# Altium schematic sheet ESP_GSM_V1.1.SchDoc: EGBV01R01130122
size A2; SheetNumber: 1; SheetTotal: 1
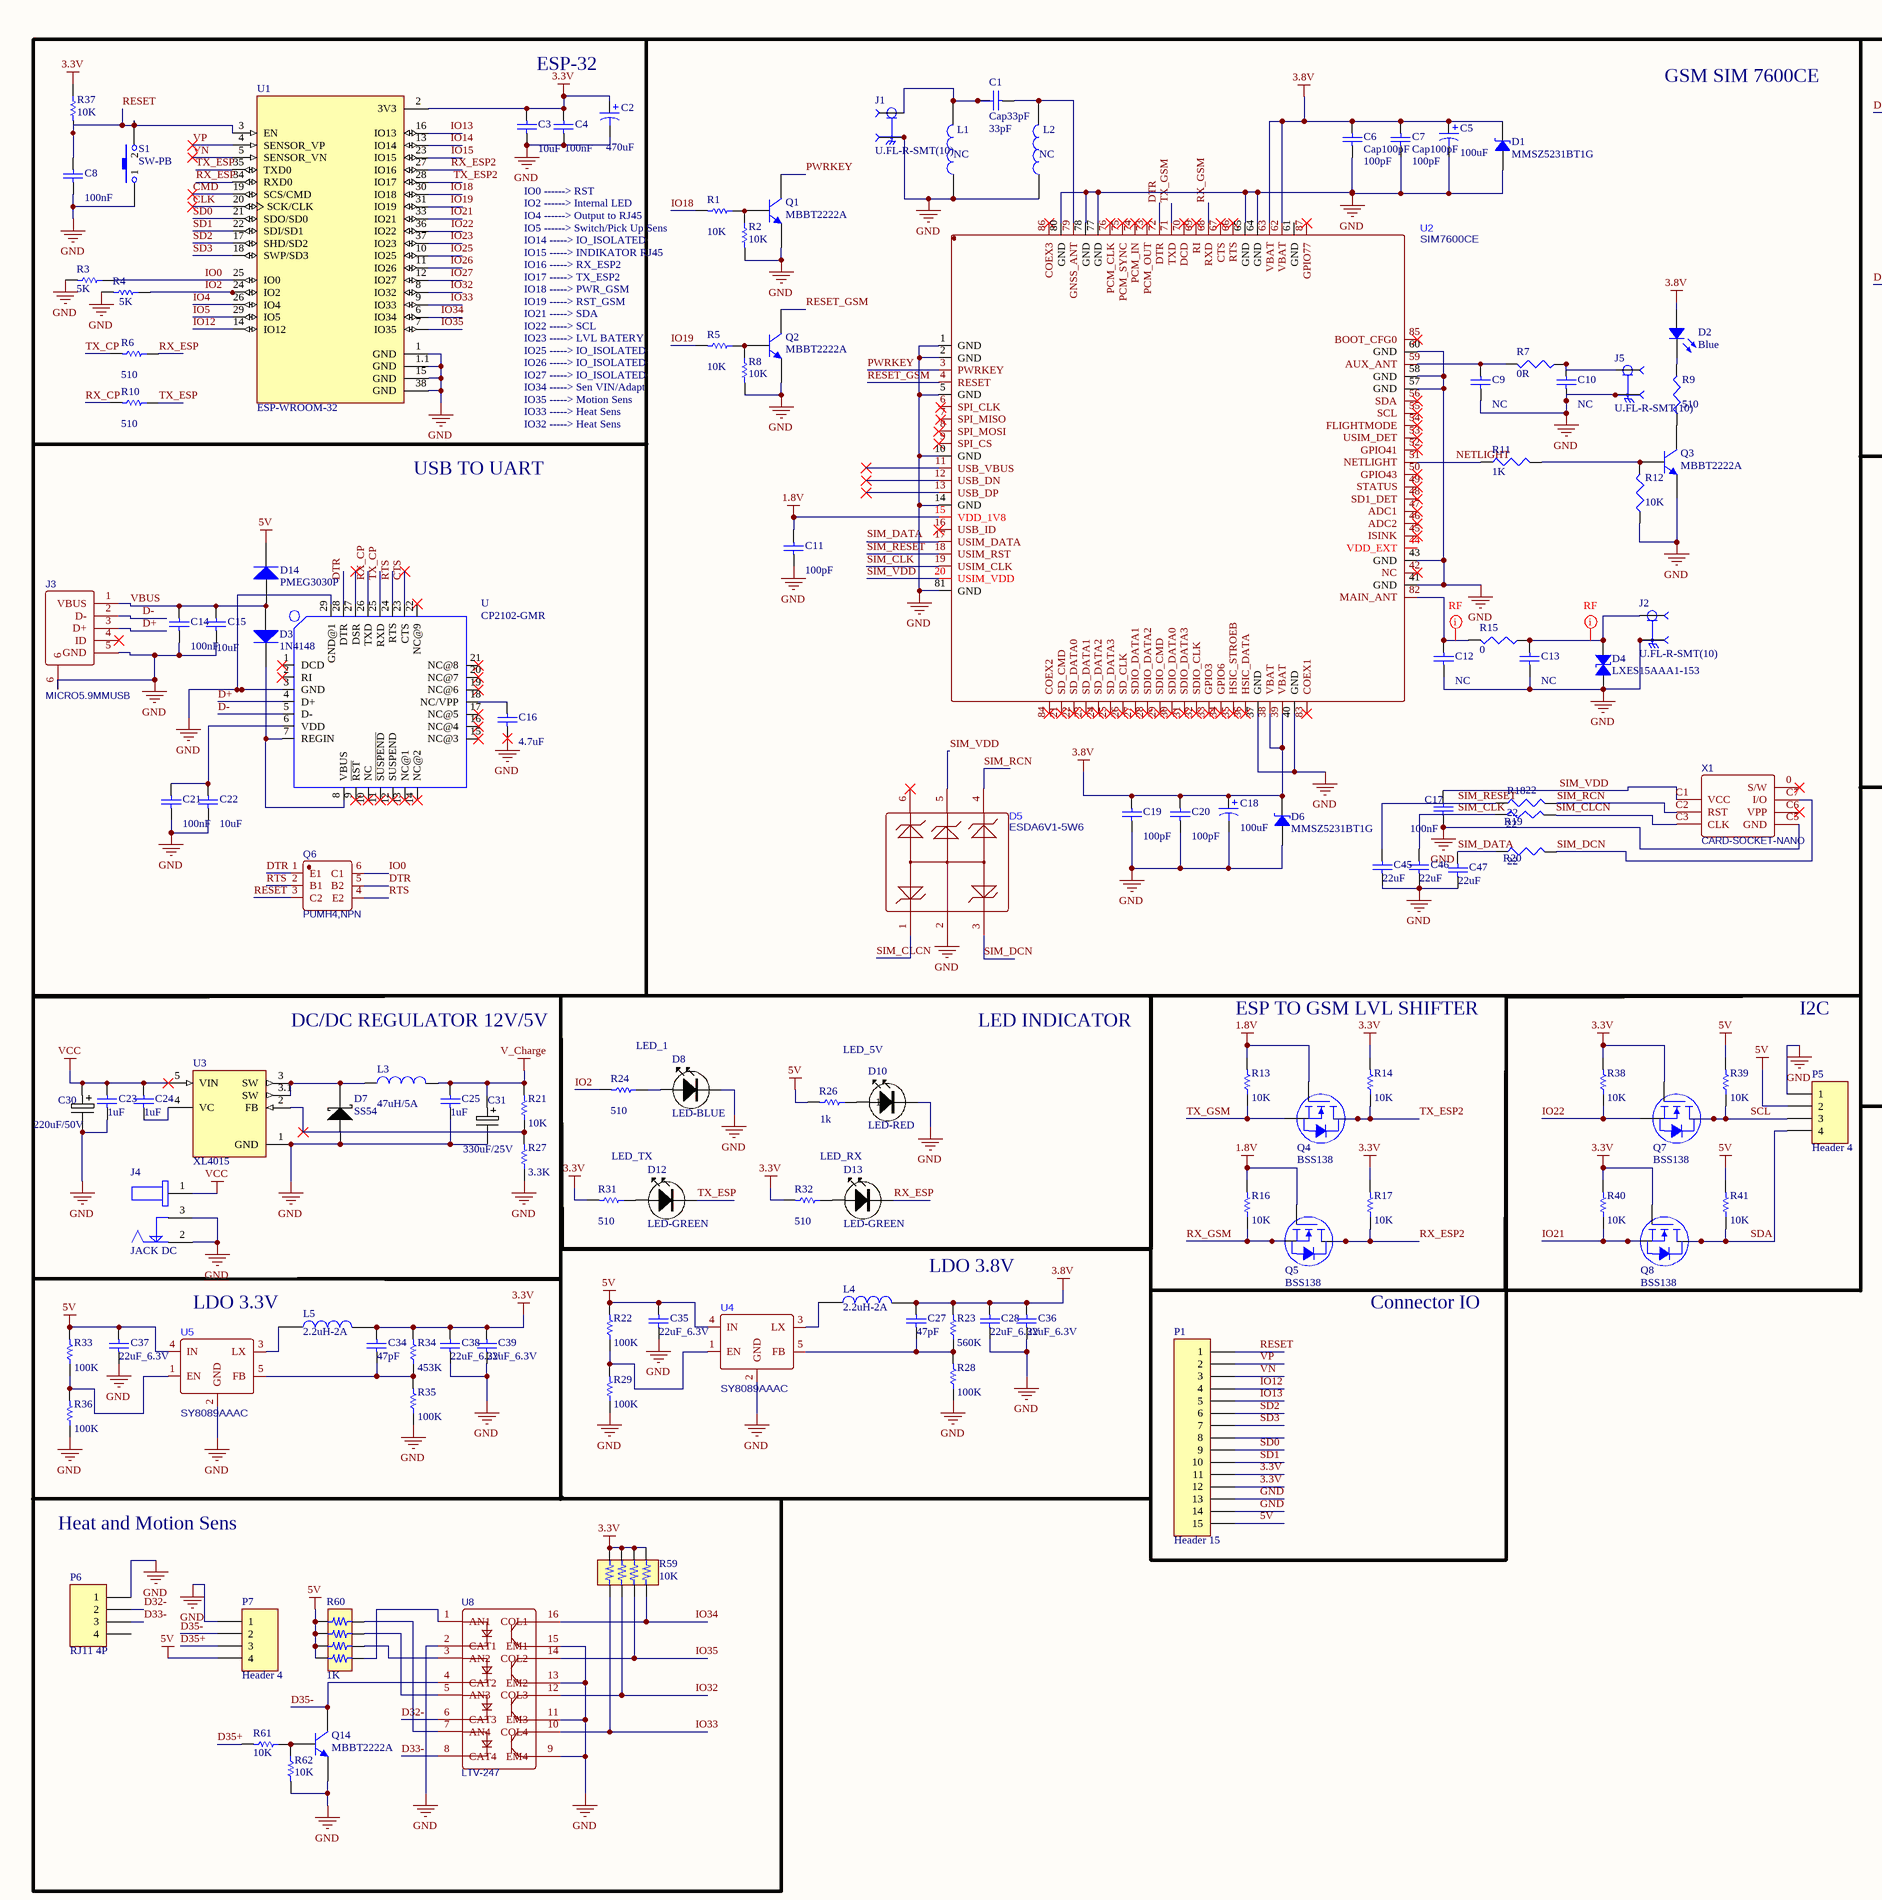
[diagram p0: ESP_GSM_V1.1.SchDoc, left]
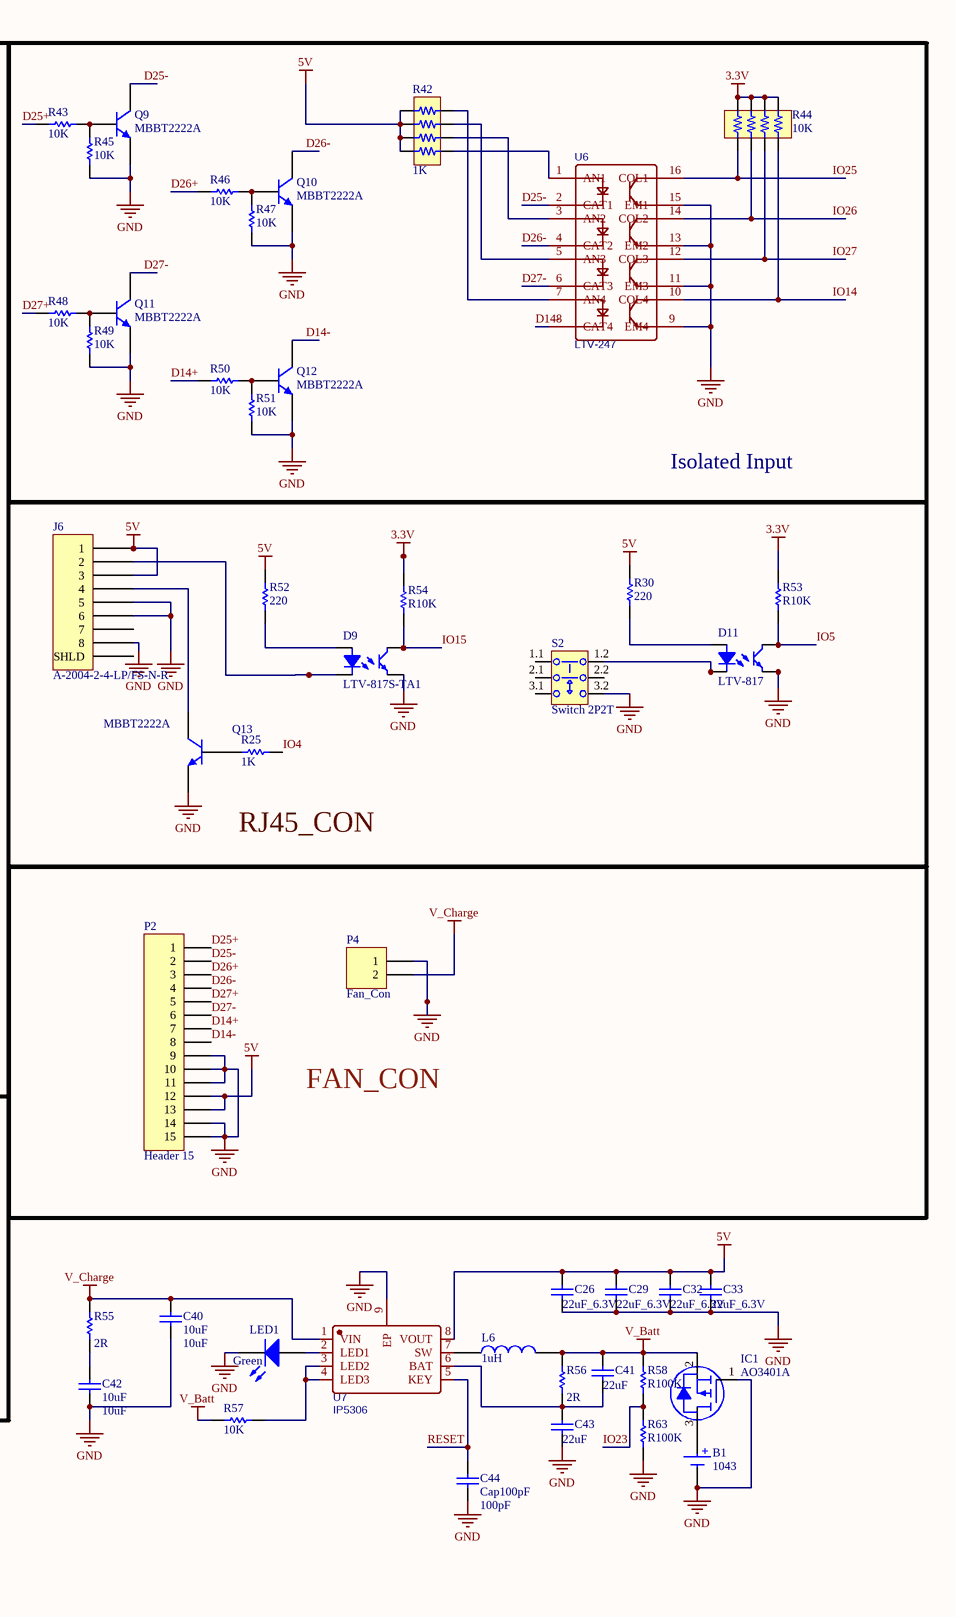
[diagram p1: ESP_GSM_V1.1.SchDoc, right]

## Parts
B1  1043  [KEYSTONE 1043]
C1  Cap33pF  value 33pF  [0603]
C2  value 470uF  [CAP-SMD_L7.3-W4.3-R-RD]  (hidden comment: CTantalum470uF)
C3  value 10uF  [0603]  (hidden comment: Cap10uF)
C4  value 100nF  [0603]  (hidden comment: Cap100nF)
C5  value 100uF  [CAP-SMD_L6.0-W3.2-R-RD]  (hidden comment: CTantalum100uF)
C6  Cap100pF  value 100pF  [0603]
C7  Cap100pF  value 100pF  [0603]
C8  value 100nF  [0603]  (hidden comment: Cap100nF)
C9  NC  [0603]
C10  NC  [0603]
C11  value 100pF  [0603]  (hidden comment: Cap100pF)
C12  NC  [0603]
C13  NC  [0603]
C14  value 100nF  [0603]  (hidden comment: Cap100nF)
C15  value 10uF  [0603]  (hidden comment: Cap10uF)
C16  value 4.7uF  [0603]  (hidden comment: Cap4.7uF)
C17  value 100nF  [0603]  (hidden comment: C100nF)
C18  value 100uF  [CAP-SMD_L6.0-W3.2-R-RD]  (hidden comment: CTantalum100uF)
C19  value 100pF  [0603]  (hidden comment: Cap100pF)
C20  value 100pF  [0603]  (hidden comment: Cap100pF)
C21  value 100nF  [0603]  (hidden comment: Cap100nF)
C22  10uF  [0603]
C23  value 1uF  [0603]  (hidden comment: Cap1uF)
C24  value 1uF  [0603]  (hidden comment: Cap1uF)
C25  value 1uF  [0603]  (hidden comment: Cap1uF)
C26  value 22uF_6.3V  [6-0805_N]  (hidden comment: Cap22uF)
C27  value 47pF  [0603]  (hidden comment: Cap47pF)
C28  value 22uF_6.3V  [6-0805_N]  (hidden comment: Cap22uF)
C29  value 22uF_6.3V  [6-0805_N]  (hidden comment: Cap22uF)
C30  220uF/50V  [CAP ALUM 10.3MM]
C31  330uF/25V  [CAP ALSMD POLY 8.3MM H10.5MM]
C32  value 22uF_6.3V  [6-0805_N]  (hidden comment: Cap22uF)
C33  value 22uF_6.3V  [6-0805_N]  (hidden comment: Cap22uF)
C34  47pF  [0603]
C35  value 22uF_6.3V  [6-0805_N]  (hidden comment: Cap22uF)
C36  value 22uF_6.3V  [6-0805_N]  (hidden comment: Cap22uF)
C37  value 22uF_6.3V  [6-0805_N]  (hidden comment: Cap22uF)
C38  value 22uF_6.3V  [6-0805_N]  (hidden comment: Cap22uF)
C39  value 22uF_6.3V  [6-0805_N]  (hidden comment: Cap22uF)
C40  10uF  [1608[0603]]
C41  value 22uF  [1608[0603]]  (hidden comment: Cap22uF)
C42  10uF  [1608[0603]]
C43  value 22uF  [1608[0603]]  (hidden comment: Cap22uF)
C44  Cap100pF  value 100pF  [1608[0603]]
C45  value 22uF  [1608[0603]]  (hidden comment: Cap22uF)
C46  value 22uF  [1608[0603]]  (hidden comment: Cap22uF)
C47  value 22uF  [1608[0603]]  (hidden comment: Cap22uF)
D1  MMSZ5231BT1G  [SOD-123]
D2  Blue  [LED 0805_2012 BLUE]
D3  1N4148  [SOD-123]
D4  LXES15AAA1-153  [0402]
D5  ESDA6V1-5W6  [SOT-363_L2.0-W1.3-P0.65-LS2.1-TL]
D6  MMSZ5231BT1G  [SOD-123]
D7  SS54  [DO214AC SMA]
D8  LED-BLUE  [LED 0805_2012 RED]
D9  LTV-817S-TA1  [LITEON LTV-817]
D10  LED-RED  [LED 0805_2012 RED]
D11  LTV-817  [LITEON LTV-817]
D12  LED-GREEN  [LED 0805_2012 RED]
D13  LED-GREEN  [LED 0805_2012 RED]
D14  PMEG3030P  [SOD-128_L3.7-W2.5-LS4.7-RD]
IC1  AO3401A  [DIODES SOT-23-3]
J1  U.FL-R-SMT(10)  [HRS_U.FL-R-SMT(10)]
J2  U.FL-R-SMT(10)  [HRS_U.FL-R-SMT(10)]
J3  MICRO5.9MMUSB  [MICRO-USB-SMD_5P-P0.65-H-F_MICRO5.9MMUSB]
J4  JACK DC  [Jack DC]
J5  U.FL-R-SMT(10)  [HRS_U.FL-R-SMT(10)]
J6  A-2004-2-4-LP/FS-N-R  [ASSMANN A-2004-2-4-LP_FS]
L1  NC  [0603]
L2  NC  [0603]
L3  47uH/5A  [INDUCTOR 2012H]
L4  2.2uH-2A  [IND-SMD_L4.5-W4.1_TMPC0412HP]
L5  2.2uH-2A  [IND-SMD_L4.5-W4.1_TMPC0412HP]
L6  1uH  [IND-SMD_L4.5-W4.1_TMPC0412HP]
LED1  Green  [LED 0805_2012 RED]
P1  Header 15  [HDR1X15]
P2  Header 15  [HDR1X15]
P4  Fan_Con  [JST XH B2B-XH-A]
P5  Header 4  [HDR1X4]
P6  RJ11 4P  [RJ11 4PC4 Right]
P7  Header 4  [HDR1X4]
Q1  MBBT2222A  [SOT-23B_N]
Q2  MBBT2222A  [SOT-23B_N]
Q3  MBBT2222A  [SOT-23B_N]
Q4  BSS138  [ON SEMI SOT-23-3]
Q5  BSS138  [ON SEMI SOT-23-3]
Q6  PUMH4,NPN  [SOT-363_L2.0-W1.3-P0.65-LS2.1-BR]
Q7  BSS138  [ON SEMI SOT-23-3]
Q8  BSS138  [ON SEMI SOT-23-3]
Q9  MBBT2222A  [SOT-23B_N]
Q10  MBBT2222A  [SOT-23B_N]
Q11  MBBT2222A  [SOT-23B_N]
Q12  MBBT2222A  [SOT-23B_N]
Q13  MBBT2222A  [SOT-23B_N]
Q14  MBBT2222A  [SOT-23B_N]
R1  value 10K  [0603]  (hidden comment: R10K)
R2  value 10K  [0603]  (hidden comment: R10K)
R3  value 5K  [0603]  (hidden comment: R5K)
R4  value 5K  [0603]  (hidden comment: R5K)
R5  R10K  [0603]  (value not drawn)
R6  value 510  [0603]  (hidden comment: R510)
R7  value 0R  [0603]  (hidden comment: R0)
R8  value 10K  [0603]  (hidden comment: R10K)
R9  value 510  [0603]  (hidden comment: R510)
R10  value 510  [0603]  (hidden comment: R510)
R11  1K  [J1-0603]
R12  value 10K  [0603]  (hidden comment: R10K)
R13  value 10K  [0603]  (hidden comment: R10K)
R14  value 10K  [0603]  (hidden comment: R10K)
R15  value 0  [J1-0603]  (hidden comment: R0)
R16  value 10K  [0603]  (hidden comment: R10K)
R17  value 10K  [0603]  (hidden comment: R10K)
R18  22  [J1-0603]
R19  22  [J1-0603]
R20  22  [J1-0603]
R21  value 10K  [0603]  (hidden comment: R10K)
R22  value 100K  [0603]  (hidden comment: R100K)
R23  value 560K  [0603]  (hidden comment: R560K)
R24  value 510  [0603]  (hidden comment: R510)
R25  1K  [1608[0603]]
R26  value 1k  [0603]  (hidden comment: R1K)
R27  value 3.3K  [0603]  (hidden comment: R3.3K)
R28  value 100K  [0603]  (hidden comment: R100K)
R29  value 100K  [0603]  (hidden comment: R100K)
R30  220  [1608[0603]]
R31  value 510  [0603]  (hidden comment: R510)
R32  value 510  [0603]  (hidden comment: R510)
R33  value 100K  [0603]  (hidden comment: R100K)
R34  value 453K  [0603]  (hidden comment: R453K)
R35  value 100K  [0603]  (hidden comment: R100K)
R36  value 100K  [0603]  (hidden comment: R100K)
R37  value 10K  [0603]  (hidden comment: R10K)
R38  value 10K  [1608[0603]]  (hidden comment: R10K)
R39  value 10K  [1608[0603]]  (hidden comment: R10K)
R40  value 10K  [1608[0603]]  (hidden comment: R10K)
R41  value 10K  [1608[0603]]  (hidden comment: R10K)
R42  1K  [RESNET 1206-8 CONCAVE]
R43  value 10K  [1608[0603]]  (hidden comment: R10K)
R44  10K  [RESNET 1206-8 CONCAVE]
R45  value 10K  [1608[0603]]  (hidden comment: R1K)
R46  value 10K  [1608[0603]]  (hidden comment: R10K)
R47  value 10K  [1608[0603]]  (hidden comment: R1K)
R48  value 10K  [1608[0603]]  (hidden comment: R10K)
R49  value 10K  [1608[0603]]  (hidden comment: R1K)
R50  value 10K  [1608[0603]]  (hidden comment: R10K)
R51  value 10K  [1608[0603]]  (hidden comment: R1K)
R52  220  [1608[0603]]
R53  R10K  [1608[0603]]
R54  R10K  [1608[0603]]
R55  2R  [1608[0603]]
R56  2R  [1608[0603]]
R57  value 10K  [1608[0603]]  (hidden comment: R10K)
R58  R100K  [1608[0603]]
R59  10K  [RESNET 1206-8 CONCAVE]
R60  1K  [RESNET 1206-8 CONCAVE]
R61  value 10K  [1608[0603]]  (hidden comment: R10K)
R62  value 10K  [1608[0603]]  (hidden comment: R1K)
R63  R100K  [1608[0603]]
S1  SW-PB  [C&K KSS]
S2  Switch 2P2T  [Switch 2P2T]
U  CP2102-GMR  [QFN28G_0.5-5X5MM]
U1  ESP-WROOM-32  [ESP 32]
U2  SIM7600CE  [SIM7600]
U3  XL4015  [CONV_XL4015]
U4  SY8089AAAC  [SOT-23-5_L3.0-W1.7-P0.95-LS2.8-BL]
U5  SY8089AAAC  [SOT-23-5_L3.0-W1.7-P0.95-LS2.8-BL]
U6  LTV-247  [SOP-16_L10.3-W5.4-P1.27-LS7.8-BL]
U7  IP5306  [ESOP-8_L4.9-W3.9-P1.27-LS6.0-BL-EP]
U8  LTV-247  [SOP-16_L10.3-W5.4-P1.27-LS7.8-BL]
X1  CARD-SOCKET-NANO  [SIM-SMD_C77877]

## Blocks framed on the sheet
ESP-32: C2-C4 C8 R3 R4 R6 R10 R37 S1 U1
GSM SIM 7600CE: C1 C5-C7 C9-C13 C17-C20 C45-C47 D1 D2 D4-D6 J1 J2 J5 L1 L2 Q1-Q3 R1 R2 R5 R7-R9 R11 R12 R15 R18-R20 U2 X1
Isolated Input: Q9-Q12 R42-R51 U6
USB TO UART: C14-C16 C21 C22 D3 D14 J3 Q6 U
FAN_CON: P2 P4
DC/DC REGULATOR 12V/5V: C23-C25 C30 C31 D7 J4 L3 R21 R27 U3
LED INDICATOR: D8 D10 D12 D13 R24 R26 R31 R32
ESP TO GSM LVL SHIFTER: Q4 Q5 R13 R14 R16 R17
I2C: P5 Q7 Q8 R38-R41
LDO 3.8V: C27 C28 C35 C36 L4 R22 R23 R28 R29 U4
LDO 3.3V: C34 C37-C39 L5 R33-R36 U5
Connector IO: P1

## Nets
1.8V: C11.2 Q4.1(G) Q5.1(G) R13.2 R16.2 U2.15(VDD_1V8)
3.3V: C2.1 C3.2 C4.2 C34.2 C38.2 C39.2 L5.2 P1.11 P1.12 Q7.1(G) Q8.1(G) R14.2 R17.2 R31.2 R32.2 R34.2 R37.1 R38.2 R40.2 R44.5 R44.6 R44.7 R44.8 R53.2 R54.2 R59.5 R59.6 R59.7 R59.8 U1.2(3V3)
3.8V: C5.1 C6.2 C7.2 C18.1 C19.2 C20.2 C27.2 C28.2 C36.2 D1.2 D2.1 D6.2 L4.2 R23.2 U2.38(VBAT) U2.39(VBAT) U2.62(VBAT) U2.63(VBAT)
5V: C26.2 C29.2 C32.2 C33.2 C35.2 C37.2 D14.2 J6.1 J6.3 P1.15 P2.12 P2.13 P5.2 P7.4 R22.2 R26.2 R30.2 R33.2 R39.2 R41.2 R42.1 R42.2 R42.3 R42.4 R52.2 R60.1 R60.2 R60.3 R60.4 U4.4(IN) U5.4(IN) U7.8(VOUT)
GND: B1.2(-) C2.2 C3.1 C4.1 C5.2 C6.1 C7.1 C8.1 C9.1 C10.1 C11.1 C12.1 C13.1 C14.1 C15.1 C16.1 C17.1 C18.2 C19.1 C20.1 C21.1 C22.1 C23.1 C25.1 C26.1 C28.1 C29.1 C30.2 C31.2 C32.1 C33.1 C35.1 C36.1 C37.1 C38.1 C39.1 C40.1 C42.1 C43.1 C44.1 C45.1 C46.1 C47.1 D1.1 D4.1 D5.2 D6.1 D7.1 D8.2 D9.3 D10.2 D11.3 IC1.1(G) J1.2(GND) J1.3(GND) J2.2(GND) J2.3(GND) J3.5(GND) J3.6 J4.2 J4.3 J5.2(GND) J5.3(GND) J6.5 J6.6 J6.8 L1.1 L2.1 LED1.2 P1.13 P1.14 P2.9 P2.10 P2.11 P2.14 P2.15 P4.1 P5.1 P6.1 P7.1 Q1.2(E) Q2.2(E) Q3.2(E) Q9.2(E) Q10.2(E) Q11.2(E) Q12.2(E) Q13.2(E) Q14.2(E) R2.2 R3.2 R4.2 R8.2 R12.1 R27.1 R28.1 R29.1 R35.1 R36.1 R45.2 R47.2 R49.2 R51.2 R62.2 R63.1 S1.1 S2.3.2 U.3(GND) U.29(GND@1) U1.1(GND) U1.1.1(GND) U1.15(GND) U1.38(GND) U2.1(GND) U2.2(GND) U2.5(GND) U2.10(GND) U2.14(GND) U2.37(GND) U2.40(GND) U2.41(GND) U2.43(GND) U2.57(GND) U2.58(GND) U2.60(GND) U2.64(GND) U2.65(GND) U2.77(GND) U2.78(GND) U2.80(GND) U2.81(GND) U3.1(GND) U4.2(GND) U5.2(GND) U6.9(EM4) U6.11(EM3) U6.13(EM2) U6.15(EM1) U7.9(EP) U8.2(CAT1) U8.9(EM4) U8.11(EM3) U8.13(EM2) U8.15(EM1) X1.C5(GND)
V_Batt: C41.2 IC1.2(S) L6.2 R56.2 R57.2 R58.2
V_Charge: C25.2 C31.1 C40.2 L3.2 P4.2 R21.2 R55.2 U7.1(VIN)
VCC: C23.2 C24.2 C30.1 J4.1 U3.5(VIN)
CLK: U1.20(SCK/CLK)
CMD: U1.19(SCS/CMD)
CTS: U.23(CTS)
D14+: P2.7 R50.2
D14-: P2.8 Q12.3(C) U6.8(CAT4)
D25+: P2.1 R43.2
D25-: P2.2 Q9.3(C) U6.2(CAT1)
D26+: P2.3 R46.2
D26-: P2.4 Q10.3(C) U6.4(CAT2)
D27+: P2.5 R48.2
D27-: P2.6 Q11.3(C) U6.6(CAT3)
D32-: P6.2 U8.6(CAT3)
D33-: P6.3 U8.8(CAT4)
D35+: P7.3 R61.2
D35-: P7.2 Q14.3(C) U8.4(CAT2)
D+: J3.3(D+) U.4(D+)
D-: J3.2(D-) U.5(D-)
DTR: Q6.1(E1) Q6.5(B2) U.28(DTR) U2.72(DTR)
IO0: Q6.6(C1) R3.1 U1.25(IO0)
IO2: R4.1 R24.2 U1.24(IO2)
IO4: R25.1 U1.26(IO4)
IO5: D11.4 R53.1 U1.29(IO5)
IO12: P1.4 U1.14(IO12)
IO13: P1.5 U1.16(IO13)
IO14: R44.4 U1.13(IO14) U6.10(COL4)
IO15: D9.4 R54.1 U1.23(IO15)
IO18: R1.2 U1.30(IO18)
IO19: R5.2 U1.31(IO19)
IO21: Q8.2(S) R40.1 U1.33(IO21)
IO22: Q7.2(S) R38.1 U1.36(IO22)
IO23: R58.1 R63.2 U1.37(IO23)
IO25: R44.1 U1.10(IO25) U6.16(COL1)
IO26: R44.2 U1.11(IO26) U6.14(COL2)
IO27: R44.3 U1.12(IO27) U6.12(COL3)
IO32: R59.2 U1.8(IO32) U8.12(COL3)
IO33: R59.1 U1.9(IO33) U8.10(COL4)
IO34: R59.4 U1.6(IO34) U8.16(COL1)
IO35: R59.3 U1.7(IO35) U8.14(COL2)
NETLIGHT: R11.1 U2.51(NETLIGHT)
PWRKEY: Q1.3(C) U2.3(PWRKEY)
RESET: C8.2 C44.2 P1.1 Q6.3(C2) R37.2 S1.2 U1.3(EN) U7.5(KEY)
RESET_GSM: Q2.3(C) U2.4(RESET)
RTS: Q6.2(B1) Q6.4(E2) U.24(RTS)
RX_CP: R10.2 U.26(TXD)
RX_ESP: D13.2 R6.1 U1.34(RXD0)
RX_ESP2: Q5.3(D) R17.1 U1.27(IO16)
RX_GSM: Q5.2(S) R16.1 U2.68(RXD)
SCL: P5.3 Q7.3(D) R39.1
SD0: P1.9 U1.21(SDO/SD0)
SD1: P1.10 U1.22(SDI/SD1)
SD2: P1.6 U1.17(SHD/SD2)
SD3: P1.7 U1.18(SWP/SD3)
SDA: P5.4 Q8.3(D) R41.1
SIM_CLCN: D5.1 R19.2 X1.C3(CLK)
SIM_CLK: C46.2 R19.1 U2.19(USIM_CLK)
SIM_DATA: C47.2 R20.1 U2.17(USIM_DATA)
SIM_DCN: D5.3 R20.2 X1.C7(I/O)
SIM_RCN: D5.4 R18.2 X1.C2(RST)
SIM_RESET: C45.2 R18.1 U2.18(USIM_RST)
SIM_VDD: C17.2 D5.5 U2.20(USIM_VDD) X1.C1(VCC)
TX_CP: R6.2 U.25(RXD)
TX_ESP: D12.2 R10.1 U1.35(TXD0)
TX_ESP2: Q4.3(D) R14.1 U1.28(IO17)
TX_GSM: Q4.2(S) R13.1 U2.71(TXD)
VBUS: C14.2 C15.2 D3.1(A) D14.1 J3.1(VBUS)
VN: P1.3 U1.5(SENSOR_VN)
VP: P1.2 U1.4(SENSOR_VP)
NetB1_1: B1.1(+) IC1.3(D)
NetC1_1: C1.1 L2.2 U2.79(GNSS_ANT)
NetC1_2: C1.2 J1.1(SIG) L1.2
NetC9_2: C9.2 R7.2 U2.59(AUX_ANT)
NetC10_2: C10.2 J5.1(SIG) R7.1
NetC12_2: C12.2 R15.2 U2.82(MAIN_ANT)
NetC13_2: C13.2 D4.2 J2.1(SIG) R15.1
NetC16_2: C16.2 U.18(NC/VPP)
NetC21_2: C21.2 C22.2 U.6(VDD)
NetC24_1: C24.1 U3.4(VC)
NetC27_1: C27.1 R23.1 R28.2 U4.5(FB)
NetC34_1: C34.1 R34.1 R35.2 U5.5(FB)
NetC41_1: C41.1 C43.2 R56.1 U7.6(BAT)
NetC42_2: C42.2 R55.1
NetD2_2: D2.2 R9.2
NetD3_2: D3.2(K) U.7(REGIN) U.8(VBUS)
NetD7_2: D7.2 L3.1 U3.3(SW) U3.3.1(SW)
NetD8_1: D8.1 R24.1
NetD9_1: D9.1 R52.1
NetD9_2: D9.2 J6.2
NetD10_1: D10.1 R26.1
NetD11_1: D11.1 R30.1
NetD11_2: D11.2 S2.1.2(3.2)
NetD12_1: D12.1 R31.1
NetD13_1: D13.1 R32.1
NetJ6_4: J6.4 Q13.3(C)
NetL4_1: L4.1 U4.3(LX)
NetL5_1: L5.1 U5.3(LX)
NetL6_1: L6.1 U7.7(SW)
NetLED1_1: LED1.1 U7.2(LED1)
NetQ1_1: Q1.1(B) R1.1 R2.1
NetQ2_1: Q2.1(B) R5.1 R8.1
NetQ3_1: Q3.1(B) R11.2 R12.2
NetQ3_3: Q3.3(C) R9.1
NetQ9_1: Q9.1(B) R43.1 R45.1
NetQ10_1: Q10.1(B) R46.1 R47.1
NetQ11_1: Q11.1(B) R48.1 R49.1
NetQ12_1: Q12.1(B) R50.1 R51.1
NetQ13_1: Q13.1(B) R25.2
NetQ14_1: Q14.1(B) R61.1 R62.1
NetR21_1: R21.1 R27.2 U3.2(FB)
NetR22_1: R22.1 R29.2 U4.1(EN)
NetR33_1: R33.1 R36.2 U5.1(EN)
NetR42_5: R42.5 U6.1(AN1)
NetR42_6: R42.6 U6.3(AN2)
NetR42_7: R42.7 U6.5(AN3)
NetR42_8: R42.8 U6.7(AN4)
NetR57_1: R57.1 U7.3(LED2) U7.4(LED3)
NetR60_5: R60.5 U8.1(AN1)
NetR60_6: R60.6 U8.3(AN2)
NetR60_7: R60.7 U8.5(AN3)
NetR60_8: R60.8 U8.7(AN4)

Not connected (* = marked no-connect by the designer): D5 6*; J3 4(ID)*; J6 7 S(SHLD); P1 8; P6 4; S2 1.1 2.1 2.2 3.1; U 1(DCD)* 2(RI)* 9(~{RST})* 10(NC)* 11(~{SUSPEND})* 12(SUSPEND)* 13(NC@1)* 14(NC@2)* 15(NC@3)* 16(NC@4)* 17(NC@5)* 19(NC@6)* 20(NC@7)* 21(NC@8)* 22(NC@9)* 27(DSR)*; U2 6(SPI_CLK) 7(SPI_MISO) 8(SPI_MOSI)* 9(SPI_CS)* 11(USB_VBUS)* 12(USB_DN)* 13(USB_DP)* 16(USB_ID)* 21(SD_CMD)* 22(SD_DATA0)* 23(SD_DATA1)* 24(SD_DATA2)* 25(SD_DATA3)* 26(SD_CLK)* 27(SDIO_DATA1)* 28(SDIO_DATA2)* 29(SDIO_CMD)* 30(SDIO_DATA0)* 31(SDIO_DATA3)* 32(SDIO_CLK)* 33(GPIO3)* 34(GPIO6)* 35(HSIC_STROEB)* 36(HSIC_DATA)* 42(NC)* 44(VDD_EXT) 45(ISINK)* 46(ADC2)* 47(ADC1)* 48(SD1_DET)* 49(STATUS)* 50(GPIO43)* 52(GPIO41)* 53(USIM_DET)* 54(FLIGHTMODE)* 55(SCL)* 56(SDA)* 61(GND) 66(RTS)* 67(CTS)* 69(RI)* 70(DCD)* 73(PCM_OUT)* 74(PCM_IN)* 75(PCM_SYNC)* 76(PCM_CLK)* 83(COEX1)* 84(COEX2)* 85(BOOT_CFG0)* 86(COEX3)* 87(GPIO77)*; X1 0(S/W)* C6(VPP)*

## Layout directives
net class RF: NetC12_2, NetC13_2

## Notes on the sheet
- IO0 ------> RST
- IO2 ------> Internal LED
- (near R1) IO4 ------> Output to RJ45
- (near R1) IO5 ------> Switch/Pick Up Sens
- IO16 -----> RX_ESP2
- IO17 -----> TX_ESP2
- IO18 -----> PWR_GSM
- IO14 -----> IO_ISOLATED
- IO15 -----> INDIKATOR RJ45
- IO21 -----> SDA
- IO22 -----> SCL
- IO19 -----> RST_GSM
- IO25 -----> IO_ISOLATED
- IO23 -----> LVL BATERY
- IO34 -----> Sen VIN/Adapt
- IO35 -----> Motion Sens
- IO33 -----> Heat Sens
- IO26 -----> IO_ISOLATED
- IO27 -----> IO_ISOLATED
- IO32 -----> Heat Sens
- RJ45_CON
- LED_1
- LED_5V
- LED_TX
- LED_RX
- Heat and Motion Sens
- Title
- Size:
- Date:
- File:
- A2
- Number:
- Time:
- Revision:
- Sheet
- of

## Library data of the parts
B1 = 1043: BATTERY HOLDER 18650 PC PIN; Manufacturer: Keystone Electronics; Battery Cell Size: 18650; Battery Type, Function: Cylindrical, Holder; Number of Cells: 1; Style: Holder (Open); Part Number: 1043; ComponentLink1Description: Datasheet; ComponentLink1URL: http://keyelco.com/userAssets/file/M65p27.pdf; ComponentLink2Description: DigiKey Link; ComponentLink2URL: http://digikey.com/product-detail/en/keystone-electronics/1043/36-1043-ND/2745669; Height Above Board: 0.585" (14.86mm); LastUpdated: 02/02/2020 09:19:56; Lifecycle Status: Active; Minimum Order: 1; Mounting Type: PCB, Through Hole; Operating Temperature: -50°C ~ 145°C; Packaging: Unknown; PartId: 2; Part Status: Active; Price: 2.58; Series: -; Supplier 1: DigiKey; Supplier Part Number 1: 36-1043-ND; Termination Style: PC Pin
C1 C6 C7 C9-C13 C17 C19 C20 C40 C42 C44 = Cap Semi: Capacitor (Semiconductor SIM Model); Published: 8-Jun-2000; LatestRevisionDate: 29-May-2009; LatestRevisionNote: IPC-7351 Footprint Added.; PackageReference: C1206; Publisher: Altium Limited; PackageDescription: Chip Capacitor
  C9 C10 C12 C13: Value: NC
  C40 C42: Value: 10uF
C2 C5 C18 = Cap Pol3: Polarized Capacitor (Surface Mount); Published: 8-Jun-2000; LatestRevisionDate: 29-May-2009; LatestRevisionNote: IPC-7351 Footprint Added.; PackageReference: C0805; Publisher: Altium Limited; PackageDescription: Chip Capacitor
C3 C4 C8 C14-C16 C21-C29 C32-C39 C41 C43 C45-C47 = Cap: Capacitor; Published: 8-Jun-2000; LatestRevisionDate: 17-Jul-2002; LatestRevisionNote: Re-released for DXP Platform.; PackageReference: RAD-0.3; Publisher: Altium Limited; PackageDescription: Radial Cap, Thru-Hole; 2 Leads; 0.3 in Pin Spacing
  C22: Value: 10uF
  C34: Value: 47pF
C30 C31 = C+-GENERIC: GENERIC CAPACITOR POLARISED
D1 D6 = Diode Zener: Zener Diode
D2 = 5990191007F: LED BLUE 0805 SMD; Manufacturer: Dialight; Configuration: Standard; Current - Test: 20mA; Lens Color: 0.80mm; Lens Size: 1.40mm x 1.25mm; Lens Style: Rectangle with Flat Top; Millicandela Rating: 105mcd; Viewing Angle: 140°; Voltage - Forward (Vf) (Typ): 3.2V; Wavelength - Dominant: 470nm; Part Number: 5990191007F; Color: Blue; ComponentLink1Description: Datasheet; ComponentLink1URL: http://www.dialightsignalsandcomponents.com/Assets/Brochures_And_Catalogs/Indication/CBI_SMD_new/Dialight_CBI_data_599-0805_Apr2018.pdf; ComponentLink2Description: DigiKey Link; ComponentLink2URL: http://digikey.com/product-detail/en/dialight/5990191007F/350-4359-1-ND/9385465; Device Package: 0805 (2012 Metric); Height (Max): 0.80mm; LastUpdated: 02/09/2020 01:20:30; Lifecycle Status: Active; Minimum Order: 1; Mounting Type: Surface Mount; Package / Case: 0805 (2012 Metric); Packaging: TapeAndReel; PartId: 759; Part Status: Active; Price: 0.10; Series: 599; Size / Dimension: 2.00mm L x 1.25mm W; Supplier 1: DigiKey; Supplier Part Number 1: 350-4359-1-ND; Supplier Device Package: 0805; Value: Blue
D3 D14 = Diode: Default Diode; Published: 8-Jun-2000; LatestRevisionDate: 17-Jul-2002; LatestRevisionNote: Re-released for DXP Platform.; PackageVersion: Sep-1996; PackageReference: SMC; Publisher: Altium Limited; PackageDescription: DO-214-AB/SMC; 2 C-Bend Leads; Body 7.9 x 5.9 mm, inc. leads (LxW); Code_JEDEC: DO-214-AB
D4 = Diode TVS: Zener Diode
D7 = DIODE-SCHOTTKY-GENERIC: GENERIC SCHOTTKY DIODE
D8 = TOPLED-BLUE: Manufacturer: Kingbright Corp; Manufacturer Part Number: AA3528APBC/A; Supplier 1: Digi-Key; Supplier Part Number 1: 754-1011-2-ND
D9 = LTV-817S-TA1: OPTOISOLATR 5KV TRANSISTOR 4-SMD; Manufacturer: Lite-On Inc.; Current - DC Forward (If) (Max): 50mA; Current Transfer Ratio (Max): 600% @ 5mA; Current Transfer Ratio (Min): 50% @ 5mA; Input Type: DC; Number of Channels: 1; Rise / Fall Time (Typ): 4µs, 3µs; Vce Saturation (Max): 200mV; Voltage - Forward (Vf) (Typ): 1.2V; Voltage - Isolation: 5000Vrms; Voltage - Output (Max): 35V; Part Number: LTV-817S-TA1; ComponentLink1Description: Datasheet; ComponentLink1URL: http://optoelectronics.liteon.com/upload/download/DS-70-96-0016/LTV-8X7%20series%20201610%20.pdf; ComponentLink2Description: DigiKey Link; ComponentLink2URL: http://digikey.com/product-detail/en/lite-on-inc/LTV-817S-TA1/160-1893-1-ND/3306757; Current - Output / Channel: 50mA; Device Package: 4-SMD, Gull Wing; LastUpdated: 12/01/2020 21:58:48; Lifecycle Status: Active; Minimum Order: 1; Mounting Type: Surface Mount; Operating Temperature: -30°C ~ 110°C; Output Type: Transistor; Package / Case: 4-SMD, Gull Wing; Packaging: TapeAndReel; Part Status: Active; Price: 0.12; Series: -; Supplier 1: DigiKey; Supplier Part Number 1: 160-1893-1-ND; Supplier Device Package: 4-SMD
D10 = TOPLED-RED: Manufacturer: OSRAM Opto Semiconductors Inc; Manufacturer Part Number: LS T676-Q1R2-1-Z; Reel: D13; Supplier 1: Digi-Key; Supplier Part Number 1: 475-1133-2-ND
D11 = Optoisolator
D12 D13 = TOPLED-GREEN
IC1 = BSS84-7-F: MOSFET P-CH 50V 130MA SOT23-3; Manufacturer: Diodes Incorporated; Current - Continuous Drain (Id) @ 25°C: 130mA (Ta); Drive Voltage (Max Rds On,  Min Rds On): 5V; FET Type: P-Channel; Input Capacitance (Ciss) (Max) @ Vds: 45pF @ 25V; Power Dissipation (Max): 300mW (Ta); Rds On (Max) @ Id, Vgs: 10Ohm @ 100mA, 5V; Vgs (Max): ±20V; Vgs(th) (Max) @ Id: 2V @ 1mA; Part Number: BSS84-7-F; ComponentLink1Description: Datasheet; ComponentLink1URL: https://www.diodes.com/assets/Datasheets/ds30149.pdf; ComponentLink2Description: DigiKey Link; ComponentLink2URL: http://digikey.com/product-detail/en/diodes-incorporated/BSS84-7-F/BSS84-FDICT-ND/717844; Drain to Source Voltage (Vdss): 50V; LastUpdated: 02/09/2020 01:25:04; Lifecycle Status: Active; Minimum Order: 1; Mounting Type: Surface Mount; Operating Temperature: -55°C ~ 150°C (TJ); Package / Case: TO-236-3, SC-59, SOT-23-3; Packaging: TapeAndReel; Part Status: Active; Price: 0.03; Series: -; Supplier 1: DigiKey; Supplier Part Number 1: BSS84-FDICT-ND; Supplier Device Package: SOT-23-3; Technology: MOSFET (Metal Oxide)
J1 J2 J5 = U.FL-R-SMT(10): U.FL _UMCC_ Connector Receptacle, Male Pin 50Ohm Surface Mount Solder; MP: U.FL-R-SMT_10_; MF: Hirose; Availability: Unavailable; SnapEDA_Link: https://www.snapeda.com/parts/U.FL-R-SMT%2810%29/Hirose%20Electric%20Co%20Ltd/view-part/46852/?ref=snap; Value: *; Price: None; Package: FakePackage u
J3 = MICRO5.9MMUSB: BOM_Manufacturer: SHOU HAN; Contributor: LCSC; BOM_Supplier: LCSC; BOM_Supplier Part: C393940; BOM_Manufacturer Part: MICRO5.9mmusb; BOM_JLCPCB Part Class: Extended Part; spicePre: U; spiceSymbolName: MICRO5.9MMUSB
J4 = DCJ200-10-A-XX-X_REVA: Power Barrel Connector Jack 2.05mm ID _0.081_, 5.50mm OD _0.217_ Through Hole, Right Angle; MP: DCJ200-10-A-K1-K; MF: Global Connector Technology; Package: None; Availability: Unavailable; Value: *; SnapEDA_Link: https://www.snapeda.com/parts/DCJ200-10-A-K1-K/Global%20Connector%20Technology/view-part/641259/?ref=snap; Price: None
J6 = A-2004-2-4-LP/FS-N-R: CONN MOD JACK 8P8C R/A SHIELDED; Manufacturer: Assmann WSW Components; LED Color: Does Not Contain LED; Number of Ports: 1; Number of Positions/Contacts: 8p8c (RJ45, Ethernet); Tab Direction: Down; Part Number: A-2004-2-4-LP/FS-N-R; ComponentLink1Description: Datasheet; ComponentLink1URL: http://www.assmann-wsw.com/fileadmin/datasheets/ASS_7039_CO.pdf; ComponentLink2Description: DigiKey Link; ComponentLink2URL: http://digikey.com/product-detail/en/assmann-wsw-components/A-2004-2-4-LP-FS-N-R/AE10386-ND/2183637; Connector Type: Jack; Contact Finish: Gold; Contact Material: Phosphor Bronze; Features: Board Lock; LastUpdated: 15/01/2020 03:58:34; Lifecycle Status: Active; Minimum Order: 1; Mounting Type: Through Hole; Number of Rows: 1; Orientation: 90° Angle (Right); Packaging: Tray; Part Status: Active; Price: 1.13; Series: -; Shielding: Shielded; Supplier 1: DigiKey; Supplier Part Number 1: AE10386-ND; Termination: Solder
L1 L2 L4-L6 = Inductor: Manufacturer: *; Manufacturer Part No: *; Component Type: Inductor; Order Code: *; Supplier: *
  L1 L2: Value: NC
  L4 L5: Value: 2.2uH-2A
  L6: Value: 1uH
L3 = Inductor: Code_IEC: 1005; Published: 8-Jun-2000; LatestRevisionDate: 29-May-2009; LatestRevisionNote: IPC-7351 Footprint Added.; PackageReference: 0402-A; Publisher: Altium Limited; PackageDescription: Chip Inductor; Code_JEITA: 0402; Value: 47uH/5A
LED1 = LED0: LED Green 3mm; Published: 8-Jun-2000; LatestRevisionDate: 08-Jul-2005; LatestRevisionNote: Mech Layer 1 removed.; PackageReference: LED-0; Publisher: Altium Limited; PackageDescription: LED; 2 Leads
P1 P2 = Header 15: Header, 15-Pin; LatestRevisionDate: 17-Jul-2002; LatestRevisionNote: Re-released for DXP Platform.; Publisher: Altium Limited
P4 = Header 2: Header, 2-Pin; LatestRevisionDate: 17-Jul-2002; LatestRevisionNote: Re-released for DXP Platform.; Publisher: Altium Limited
P5-P7 = Header 4: Header, 4-Pin; LatestRevisionDate: 17-Jul-2002; LatestRevisionNote: Re-released for DXP Platform.; Publisher: Altium Limited
Q1-Q3 Q9-Q14 = QNPN: NPN Bipolar Transistor; Published: 8-Jun-2000; LatestRevisionDate: 29-May-2009; LatestRevisionNote: IPC-7351 Footprint Added.; PackageVersion: Aug-1999; PackageReference: SOT-23B; Publisher: Altium Limited; PackageDescription: 3-Pin SOT-23 Package 0.95 mm Pitch, 2.4 mm Lead Span
Q4 Q5 Q7 Q8 = BSS138: MOSFET N-CH 50V 220MA SOT-23; Manufacturer: ON Semiconductor; Current - Continuous Drain (Id) @ 25°C: 220mA (Ta); Drive Voltage (Max Rds On,  Min Rds On): 4.5V, 10V; FET Type: N-Channel; Gate Charge (Qg) (Max) @ Vgs: 2.4nC @ 10V; Input Capacitance (Ciss) (Max) @ Vds: 27pF @ 25V; Power Dissipation (Max): 360mW (Ta); Rds On (Max) @ Id, Vgs: 3.5Ohm @ 220mA, 10V; Vgs (Max): ±20V; Vgs(th) (Max) @ Id: 1.5V @ 1mA; Part Number: BSS138; ComponentLink1Description: Datasheet; ComponentLink1URL: https://www.onsemi.com/pub/Collateral/BSS138-D.PDF; ComponentLink2Description: DigiKey Link; ComponentLink2URL: http://digikey.com/product-detail/en/on-semiconductor/BSS138/BSS138CT-ND/244294; Drain to Source Voltage (Vdss): 50V; LastUpdated: 02/09/2020 01:25:08; Lifecycle Status: Active; Minimum Order: 1; Mounting Type: Surface Mount; Operating Temperature: -55°C ~ 150°C (TJ); Package / Case: TO-236-3, SC-59, SOT-23-3; Packaging: TapeAndReel; Part Status: Active; Price: 0.05; Series: -; Supplier 1: DigiKey; Supplier Part Number 1: BSS138CT-ND; Supplier Device Package: SOT-23-3; Technology: MOSFET (Metal Oxide)
Q6 = PUMH4,115: BOM_Manufacturer: Nexperia; Contributor: LCSC; BOM_Supplier: LCSC; BOM_Supplier Part: C455002; BOM_Manufacturer Part: PUMH4,115; BOM_JLCPCB Part Class: Extended Part; spicePre: Q; spiceSymbolName: PUMH4,115
R1-R6 R8 R10 R13 R14 R16 R17 R21-R24 R26-R41 R43 R45-R52 R55-R57 R61 R62 = Res1: Resistor; Published: 8-Jun-2000; LatestRevisionDate: 17-Jul-2002; LatestRevisionNote: Re-released for DXP Platform.; PackageReference: AXIAL-0.3; Publisher: Altium Limited; PackageDescription: Axial Device, Thru-Hole; 2 Leads; 0.3 in Pin Spacing
  R5: 10k: 10K
  R30 R52: Value: 220
  R55 R56: Value: 2R
R7 R9 R11 R12 R15 R18-R20 = Res3: Resistor; Published: 8-Jun-2000; LatestRevisionDate: 29-May-2009; LatestRevisionNote: IPC-7351 Footprint Added.; PackageReference: J1-0603; Publisher: Altium Limited; PackageDescription: Chip Resistor
  R11: Value: 1K
  R18-R20: Value: 22
R25 = Res1: Resistor; Value: 220; Published: 8-Jun-2000; LatestRevisionDate: 17-Jul-2002; LatestRevisionNote: Re-released for DXP Platform.; PackageReference: AXIAL-0.3; Publisher: Altium Limited; PackageDescription: Axial Device, Thru-Hole; 2 Leads; 0.3 in Pin Spacing
R42 R59 R60 = CAT10-102J4LF: RES ARRAY 4 RES 1K OHM 0804; Manufacturer: Bourns Inc.; Circuit Type: Isolated; Number of Resistors: 4; Power Per Element: 62.5mW; Temperature Coefficient: ±250ppm/°C; Tolerance: ±5%; Part Number: CAT10-102J4LF; ComponentLink1Description: Datasheet; ComponentLink1URL: https://www.bourns.com/docs/Product-Datasheets/CAT10.pdf; ComponentLink2Description: DigiKey Link; ComponentLink2URL: http://digikey.com/product-detail/en/bourns-inc/CAT10-102J4LF/CAT10-102J4LFCT-ND/3925486; Height - Seated (Max): 0.022" (0.55mm); LastUpdated: 02/09/2020 01:23:34; Lifecycle Status: Active; Minimum Order: 1; Mounting Type: Surface Mount; Number of Pins: 8; Operating Temperature: -55°C ~ 125°C; Package / Case: 0804, Concave, Long Side Terminals; Packaging: TapeAndReel; PartId: 959; Part Status: Active; Price: 0.01; Resistance (Ohms): 1k; Series: CAT10; Size / Dimension: 0.079" L x 0.039" W (2.00mm x 1.00mm); Supplier 1: DigiKey; Supplier Part Number 1: CAT10-102J4LFCT-ND; Supplier Device Package: 0804
R44 = CAT10-102J4LF: RES ARRAY 4 RES 10K OHM 0804; Manufacturer: Bourns Inc.; Circuit Type: Isolated; Number of Resistors: 4; Power Per Element: 62.5mW; Resistance (Ohms): 1k; Temperature Coefficient: ±250ppm/°C; Tolerance: ±5%; Part Number: CAT10-102J4LF; ComponentLink1Description: Datasheet; ComponentLink1URL: https://www.bourns.com/docs/Product-Datasheets/CAT10.pdf; ComponentLink2Description: DigiKey Link; ComponentLink2URL: http://digikey.com/product-detail/en/bourns-inc/CAT10-102J4LF/CAT10-102J4LFCT-ND/3925486; Height - Seated (Max): 0.022" (0.55mm); LastUpdated: 02/09/2020 01:23:34; Lifecycle Status: Active; Minimum Order: 1; Mounting Type: Surface Mount; Number of Pins: 8; Operating Temperature: -55°C ~ 125°C; Package / Case: 0804, Concave, Long Side Terminals; Packaging: TapeAndReel; PartId: 959; Part Status: Active; Price: 0.01; Series: CAT10; Size / Dimension: 0.079" L x 0.039" W (2.00mm x 1.00mm); Supplier 1: DigiKey; Supplier Part Number 1: CAT10-102J4LFCT-ND; Supplier Device Package: 0804
R53 R54 = Res1: Resistor; Value: 10K; Published: 8-Jun-2000; LatestRevisionDate: 17-Jul-2002; LatestRevisionNote: Re-released for DXP Platform.; PackageReference: AXIAL-0.3; Publisher: Altium Limited; PackageDescription: Axial Device, Thru-Hole; 2 Leads; 0.3 in Pin Spacing
R58 R63 = Res1: Resistor; Value: 100K; Published: 8-Jun-2000; LatestRevisionDate: 17-Jul-2002; LatestRevisionNote: Re-released for DXP Platform.; PackageReference: AXIAL-0.3; Publisher: Altium Limited; PackageDescription: Axial Device, Thru-Hole; 2 Leads; 0.3 in Pin Spacing
S1 = SW-PB: Switch; Published: 24-Mar-1999; LatestRevisionDate: 17-Jul-2002; LatestRevisionNote: Re-released for DXP Platform.; PackageReference: SPST-2; Publisher: Altium Limited; PackageDescription: Switch; 2 Leads
U = INTERFACE-CP2102-GMR(QFN28): USB Bridge, USB to UART USB 2.0 UART Interface 28-QFN _5x5_; MF: Silicon; SnapEDA_Link: https://www.snapeda.com/parts/CP2102-GMR/Silicon%20Labs/view-part/570818/?ref=snap; MP: CP2102-GMR; Price: None; Availability: Unavailable; Value: *; Package: VFQFN-28 Vishay Siliconix
U1 = ESP-WROOM-32: WiFi 802.11b/g/n/d/e/i Transceiver Module 2.4GHz Surface Mount; MF: Olimex LTD; Value: *; SnapEDA_Link: https://www.snapeda.com/parts/ESP-WROOM-32/Olimex%20LTD/view-part/2311927/?ref=snap; MP: ESP-WROOM-32; Availability: Unavailable; Price: None; Package: Module Olimex LTD
U3 = XL4015: 5A 180KHz 36V Buck DC to DC Converter; MF: XLSEMI; Value: *; Availability: Unavailable; Price: None; SnapEDA_Link: https://www.snapeda.com/parts/XL4015/XLSEMI/view-part/4725363/?ref=snap; Package: Package; MP: XL4015
U6 U8 = LTV-247: BOM_Manufacturer: LITEON; Contributor: LCSC; BOM_Supplier: LCSC; BOM_Manufacturer Part: LTV-247; BOM_Supplier Part: C115451; BOM_JLCPCB Part Class: Extended Part; spicePre: U; spiceSymbolName: LTV-247
U7 = IP5306: BOM_Manufacturer: INJOINIC; Contributor: LCSC; BOM_Supplier: LCSC; BOM_Supplier Part: C181692; BOM_Manufacturer Part: IP5306; BOM_JLCPCB Part Class: Extended Part; spicePre: U; spiceSymbolName: IP5306
X1 = nano1.4_c77877: BOM_Manufacturer: Boom Precision Elec; Contributor: 立创EDA官方封装库; BOM_Supplier: LCSC; BOM_Supplier Part: C77877; BOM_Manufacturer Part: -; BOM_JLCPCB Part Class: Extended Part; spicePre: C; spiceSymbolName: nano1.4_c77877